# Altium schematic sheet board.SchDoc
size A4
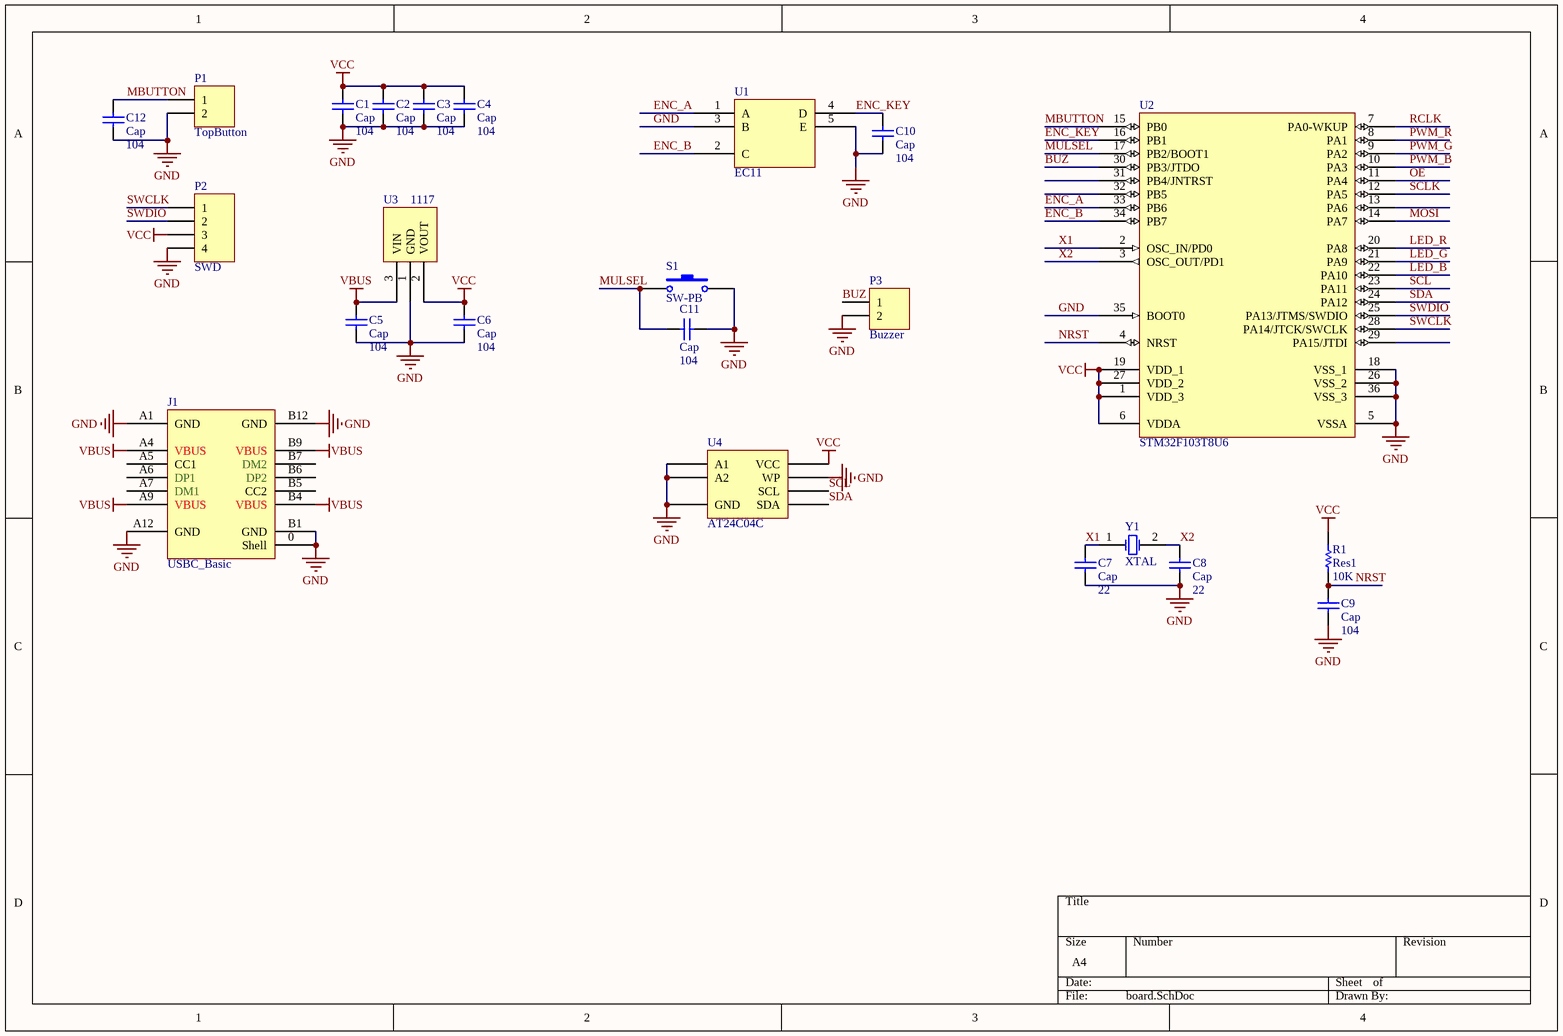
[diagram p0: board.SchDoc]

## Parts
C1  Cap  value 104  [0805]
C2  Cap  value 104  [0805]
C3  Cap  value 104  [0805]
C4  Cap  value 104  [0805]
C5  Cap  value 104  [0805]
C6  Cap  value 104  [0805]
C7  Cap  value 22  [0805]
C8  Cap  value 22  [0805]
C9  Cap  value 104  [0805]
C10  Cap  value 104  [0805]
C11  Cap  value 104  [0805]
C12  Cap  value 104  [0805]
J1  USBC_Basic  [USBC_BS]
P1  TopButton  [HDR1X2]
P2  SWD  [HDR1X4]
P3  Buzzer  [BUZZER_SMT]
R1  Res1  value 10K  [0805]
S1  SW-PB  [SW_PB_665]
U1  EC11  [EC11]
U2  STM32F103T8U6  [QFN36]
U3  1117  [SOT-223]
U4  AT24C04C  [SO-08]
Y1  XTAL  [XTAL-5]

## Nets
GND: C1.1 C2.1 C3.1 C4.1 C5.1 C6.1 C7.1 C8.1 C9.1 C10.1 C11.1 C12.1 J1.0(Shell) J1.A1(GND) J1.A12(GND) J1.B1(GND) J1.B12(GND) P1.2 P2.4 P3.2 S1.2 U1.3(B) U1.5(E) U2.5(VSSA) U2.18(VSS_1) U2.26(VSS_2) U2.35(BOOT0) U2.36(VSS_3) U3.1(GND) U4.2(A1) U4.3(A2) U4.4(GND) U4.7(WP)
VBUS: C5.2 J1.A4(VBUS) J1.A9(VBUS) J1.B4(VBUS) J1.B9(VBUS) U3.3(VIN)
VCC: C1.2 C2.2 C3.2 C4.2 C6.2 P2.3 R1.2 U2.1(VDD_3) U2.6(VDDA) U2.19(VDD_1) U2.27(VDD_2) U3.2(VOUT) U4.8(VCC)
BUZ: P3.1 U2.30(PB3/JTDO)
ENC_A: U1.1(A) U2.33(PB6)
ENC_B: U1.2(C) U2.34(PB7)
ENC_KEY: C10.2 U1.4(D) U2.16(PB1)
LED_B: U2.22(PA10)
LED_G: U2.21(PA9)
LED_R: U2.20(PA8)
MBUTTON: C12.2 P1.1 U2.15(PB0)
MOSI: U2.14(PA7)
MULSEL: C11.2 S1.1 U2.17(PB2/BOOT1)
NRST: C9.2 R1.1 U2.4(NRST)
OE: U2.11(PA4)
PWM_B: U2.10(PA3)
PWM_G: U2.9(PA2)
PWM_R: U2.8(PA1)
RCLK: U2.7(PA0-WKUP)
SCL: U2.23(PA11) U4.6(SCL)
SCLK: U2.12(PA5)
SDA: U2.24(PA12) U4.5(SDA)
SWCLK: P2.1 U2.28(PA14/JTCK/SWCLK)
SWDIO: P2.2 U2.25(PA13/JTMS/SWDIO)
X1: C7.2 U2.2(OSC_IN/PD0) Y1.1(OSC1)
X2: C8.2 U2.3(OSC_OUT/PD1) Y1.2(OSC2)

Not connected (* = marked no-connect by the designer): J1 A5(CC1) A6(DP1) A7(DM1) B5(CC2) B6(DP2) B7(DM2); U2 13(PA6) 29(PA15/JTDI) 31(PB4/JNTRST) 32(PB5)

## Library data of the parts
C1-C12 = Cap: Capacitor; Published: 8-Jun-2000; LatestRevisionDate: 17-Jul-2002; LatestRevisionNote: Re-released for DXP Platform.; PackageReference: RAD-0.3; Publisher: Altium Limited; PackageDescription: Radial Cap, Thru-Hole; 2 Leads; 0.3 in Pin Spacing
J1 = USB-C_BASIC
P1 P3 = Header 2: Header, 2-Pin; LatestRevisionDate: 17-Jul-2002; LatestRevisionNote: Re-released for DXP Platform.; Publisher: Altium Limited
P2 = Header 4: Header, 4-Pin; LatestRevisionDate: 17-Jul-2002; LatestRevisionNote: Re-released for DXP Platform.; Publisher: Altium Limited
R1 = Res1: Resistor; Published: 8-Jun-2000; LatestRevisionDate: 17-Jul-2002; LatestRevisionNote: Re-released for DXP Platform.; PackageReference: AXIAL-0.3; Publisher: Altium Limited; PackageDescription: Axial Device, Thru-Hole; 2 Leads; 0.3 in Pin Spacing
S1 = SW-PB: Switch; Published: 24-Mar-1999; LatestRevisionDate: 17-Jul-2002; LatestRevisionNote: Re-released for DXP Platform.; PackageReference: SPST-2; Publisher: Altium Limited; PackageDescription: Switch; 2 Leads
U1 = EC11: Encoder with SW-PB
U2 = STM32F103T8U6: STM32 ARM-based 32-bit MCU with 64 Kbytes Flash, 36-pin VFQFPN, Industrial Temperature; Published: *; DatasheetVersion: *; PackageVersion: *; PackageReference: *; Publisher: *; PackageDescription: *; ComponentLink1Description: *; ComponentLink1URL: *; ComponentLink2Description: *; ComponentLink2URL: *
U3 = 1117_3.3: 5V-3.3V Voltage Regulator
Y1 = XTAL: Crystal Oscillator; Published: 8-Jun-2000; LatestRevisionDate: 17-Jul-2002; LatestRevisionNote: Re-released for DXP Platform.; PackageReference: R38; Publisher: Altium Limited; PackageDescription: Crystal, Thru-Hole; 2 Leads; Body 3.1 x 8.2 mm (Dia.xH)